# Altium schematic sheet SATA.schdoc: TEBF0808 - SATA
size A4; DocumentNumber: TEBF0808; Revision: 04; SheetNumber: 11; SheetTotal: 36; Date: 2016-09-29; CompanyName: Trenz Electronic GmbH; Organization: Trenz Electronic GmbH
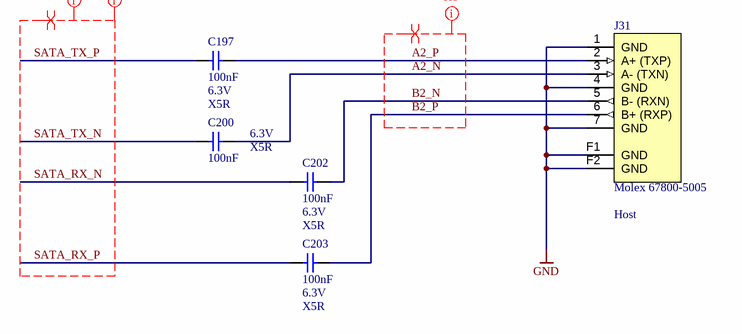
[diagram p0: SATA.schdoc]

## Parts
C197  100nF  Voltage: 6.3V  Technology: X5R  [CAPC0603X33N]
C200  100nF  Voltage: 6.3V  Technology: X5R  [CAPC0603X33N]
C202  100nF  Voltage: 6.3V  Technology: X5R  [CAPC0603X33N]
C203  100nF  Voltage: 6.3V  Technology: X5R  [CAPC0603X33N]
J31  Molex 67800-5005  [67800-5005]

## Nets
GND: J31.1(GND) J31.4(GND) J31.7(GND) J31.F1(GND) J31.F2(GND)
A2_N: C200.2 J31.3(A-_(TXN))
A2_P: C197.2 J31.2(A+_(TXP))
B2_N: C202.2 J31.5(B-_(RXN))
B2_P: C203.2 J31.6(B+_(RXP))
SATA_RX_N: C202.1
SATA_RX_P: C203.1
SATA_TX_N: C200.1
SATA_TX_P: C197.1

## Layout directives
differential pair: A2_N, A2_P, B2_N, B2_P, SATA_RX_N, SATA_RX_P, SATA_TX_N, SATA_TX_P
net class HS: A2_N, A2_P, B2_N, B2_P, SATA_RX_N, SATA_RX_P, SATA_TX_N, SATA_TX_P
net class SATA: SATA_RX_N, SATA_RX_P, SATA_TX_N, SATA_TX_P

## Notes on the sheet
- (near J31) Host
- Title:
- Number:
- Rev.
- Date:
- A4
- Copyright:
- Page
- of
- Filename:

## Library data of the parts
C197 C200 C202 C203 = 24915: KON 100nF 6.3V X5R SMD 10%; AN: 24915; Mixed: SMT; Value: 100n; Preferred: Yes; Case: 0603 (0201); Tolerance: 10%
J31 = 25614: SATA 7Pol. Connector Vertical; AN: 25614; Mixed: SMT; HelpURL: B:\AD\adlib\datasheet\67800-5005; H-ART: 67800-5005